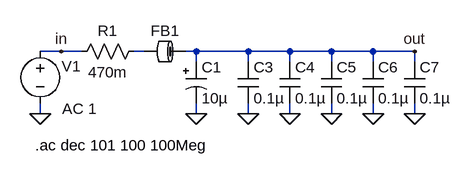
[diagram p0: schematic 01_500KHz_filter.asc]
01_500KHz_filter.asc, the LTspice schematic file:
Version 4
SHEET 1 880 680
WIRE 144 112 112 112
WIRE 176 112 144 112
WIRE 272 112 256 112
WIRE 352 112 336 112
WIRE 432 112 352 112
WIRE 496 112 432 112
WIRE 560 112 496 112
WIRE 624 112 560 112
WIRE 688 112 624 112
WIRE 352 128 352 112
WIRE 432 128 432 112
WIRE 496 128 496 112
WIRE 560 128 560 112
WIRE 624 128 624 112
WIRE 688 128 688 112
WIRE 112 208 112 192
WIRE 352 208 352 192
WIRE 432 208 432 192
WIRE 496 208 496 192
WIRE 560 208 560 192
WIRE 624 208 624 192
WIRE 688 208 688 192
FLAG 352 208 0
FLAG 112 208 0
FLAG 688 112 out
FLAG 144 112 in
FLAG 432 208 0
FLAG 496 208 0
FLAG 560 208 0
FLAG 624 208 0
FLAG 688 208 0
SYMBOL polcap 336 128 R0
WINDOW 3 24 56 Left 2
SYMATTR Value 10µ
SYMATTR InstName C1
SYMATTR Description Capacitor
SYMATTR Type cap
SYMATTR SpiceLine V=10 Irms=1.18322 Rser=0.08 Lser=0 mfg="KEMET" pn="T525A106M010ATE080" type="Tantalum"
SYMBOL voltage 112 96 R0
WINDOW 0 33 39 Left 2
WINDOW 3 34 76 Left 2
WINDOW 123 34 104 Left 2
WINDOW 39 0 0 Left 0
SYMATTR InstName V1
SYMATTR Value ""
SYMATTR Value2 AC 1
SYMBOL cap 416 128 R0
SYMATTR InstName C3
SYMATTR Value 0.1µ
SYMATTR SpiceLine V=50 Irms=728m Rser=0.14361 Lser=0 mfg="KEMET" pn="C0603C104K5RAC" type="X7R"
SYMBOL cap 480 128 R0
SYMATTR InstName C4
SYMATTR Value 0.1µ
SYMATTR SpiceLine V=50 Irms=728m Rser=0.14361 Lser=0 mfg="KEMET" pn="C0603C104K5RAC" type="X7R"
SYMBOL cap 544 128 R0
SYMATTR InstName C5
SYMATTR Value 0.1µ
SYMATTR SpiceLine V=50 Irms=728m Rser=0.14361 Lser=0 mfg="KEMET" pn="C0603C104K5RAC" type="X7R"
SYMBOL cap 608 128 R0
SYMATTR InstName C6
SYMATTR Value 0.1µ
SYMATTR SpiceLine V=50 Irms=728m Rser=0.14361 Lser=0 mfg="KEMET" pn="C0603C104K5RAC" type="X7R"
SYMBOL cap 672 128 R0
SYMATTR InstName C7
SYMATTR Value 0.1µ
SYMATTR SpiceLine V=50 Irms=728m Rser=0.14361 Lser=0 mfg="KEMET" pn="C0603C104K5RAC" type="X7R"
SYMBOL BLM18AG601SN1 304 112 R90
WINDOW 0 -16 0 VBottom 2
SYMATTR InstName FB1
SYMBOL res 272 96 R90
WINDOW 0 0 56 VBottom 2
WINDOW 3 32 56 VTop 2
SYMATTR InstName R1
SYMATTR Value 470m
TEXT 104 256 Left 2 !.ac dec 101 100 100Meg

The netlist it stands for:
* 01_500KHz_filter.asc
C1 out 0 10µ V=10 Irms=1.18322 Rser=0.08 Lser=0 mfg="KEMET" pn="T525A106M010ATE080" type="Tantalum"
V1 in 0 AC 1
C3 out 0 0.1µ V=50 Irms=728m Rser=0.14361 Lser=0 mfg="KEMET" pn="C0603C104K5RAC" type="X7R"
C4 out 0 0.1µ V=50 Irms=728m Rser=0.14361 Lser=0 mfg="KEMET" pn="C0603C104K5RAC" type="X7R"
C5 out 0 0.1µ V=50 Irms=728m Rser=0.14361 Lser=0 mfg="KEMET" pn="C0603C104K5RAC" type="X7R"
C6 out 0 0.1µ V=50 Irms=728m Rser=0.14361 Lser=0 mfg="KEMET" pn="C0603C104K5RAC" type="X7R"
C7 out 0 0.1µ V=50 Irms=728m Rser=0.14361 Lser=0 mfg="KEMET" pn="C0603C104K5RAC" type="X7R"
XFB1 out N001 BLM18AG601SN1  ; pins A B
R1 N001 in 470m
.ac dec 101 100 100Meg
.lib BLM18AG601SN1.mod
.backanno
.end